# EAGLE design HighVBoard_2.0 (EAGLE 9.6.2)
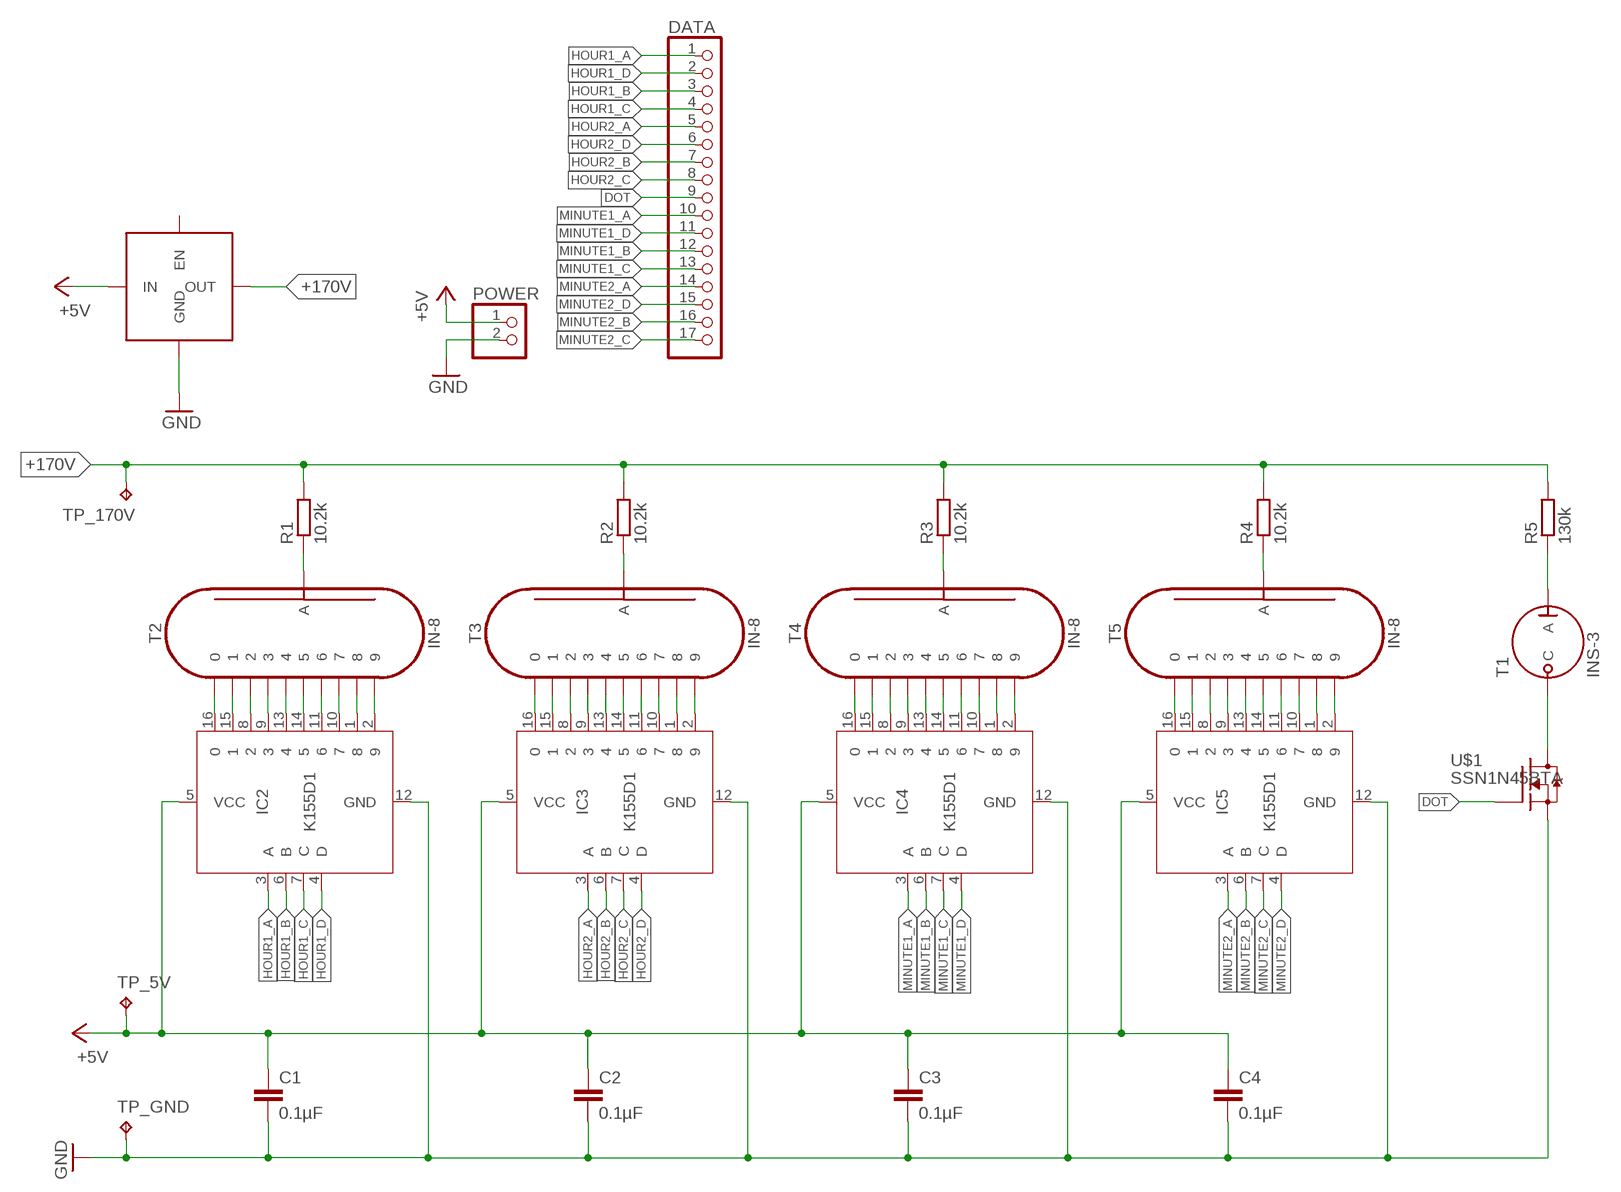
[diagram p0: schematic, sheet 1]

## Parts
C1  0.1µF  C-EU025-024X044  [C025-024X044]
C2  0.1µF  C-EU025-024X044  [C025-024X044]
C3  0.1µF  C-EU025-024X044  [C025-024X044]
C4  0.1µF  C-EU025-024X044  [C025-024X044]
DATA  PINHD-1X17  [1X17]
IC2  K155D1  [DIL16]
IC3  K155D1  [DIL16]
IC4  K155D1  [DIL16]
IC5  K155D1  [DIL16]
POWER  PINHD-1X2  [1X02]
R1  10.2k  R-EU_0207/10  [0207/10]
R2  10.2k  R-EU_0207/10  [0207/10]
R3  10.2k  R-EU_0207/10  [0207/10]
R4  10.2k  R-EU_0207/10  [0207/10]
R5  130k  R-EU_0207/10  [0207/10]
T1  INS-3  [INS-3]
T2  IN-8  [IN-8]
T3  IN-8  [IN-8]
T4  IN-8  [IN-8]
T5  IN-8  [IN-8]
TP_5V  TPPAD1-13  [P1-13]
TP_170V  TPPAD1-13  [P1-13]
TP_GND  TPPAD1-13  [P1-13]
U$1  SSN1N45BTA  [TO92]
U$2  NIXIE-PSU  [NIXIE-PSU]

## Nets
+5V [+5V]: C1.1 C2.1 C3.1 C4.1 IC2.5(VCC) IC3.5(VCC) IC4.5(VCC) IC5.5(VCC) POWER.1 TP_5V.TP U$2.1(IN)
+170V [+170V]: R1.2 R2.2 R3.2 R4.2 R5.2 TP_170V.TP U$2.5(OUT)
DOT: DATA.9 U$1.1(G)
GND [GND]: C1.2 C2.2 C3.2 C4.2 IC2.12(GND) IC3.12(GND) IC4.12(GND) IC5.12(GND) POWER.2 TP_GND.TP U$1.3(S) U$2.2(GND) U$2.4(GND)
HOUR1_A: DATA.1 IC2.3(A)
HOUR1_B: DATA.3 IC2.6(B)
HOUR1_C: DATA.4 IC2.7(C)
HOUR1_D: DATA.2 IC2.4(D)
HOUR2_A: DATA.5 IC3.3(A)
HOUR2_B: DATA.7 IC3.6(B)
HOUR2_C: DATA.8 IC3.7(C)
HOUR2_D: DATA.6 IC3.4(D)
MINUTE1_A: DATA.10 IC4.3(A)
MINUTE1_B: DATA.12 IC4.6(B)
MINUTE1_C: DATA.13 IC4.7(C)
MINUTE1_D: DATA.11 IC4.4(D)
MINUTE2_A: DATA.14 IC5.3(A)
MINUTE2_B: DATA.16 IC5.6(B)
MINUTE2_C: DATA.17 IC5.7(C)
MINUTE2_D: DATA.15 IC5.4(D)
N$1: T1.C U$1.2(D)
N$7 [+170V]: IC2.16 T2.10
N$10 [+170V]: IC2.15 T2.1
N$11 [+170V]: IC2.8 T2.2
N$12 [+170V]: IC2.9 T2.3
N$13 [+170V]: IC2.13 T2.4
N$14 [+170V]: IC2.14 T2.5
N$15 [+170V]: IC2.11 T2.6
N$16 [+170V]: IC2.10 T2.7
N$17 [+170V]: IC2.1 T2.8
N$18 [+170V]: IC2.2 T2.9
N$19 [+170V]: R1.1 T2.A
N$20 [+170V]: IC3.16 T3.10
N$21 [+170V]: IC3.15 T3.1
N$22 [+170V]: IC3.8 T3.2
N$23 [+170V]: IC3.9 T3.3
N$24 [+170V]: IC3.13 T3.4
N$25 [+170V]: IC3.14 T3.5
N$26 [+170V]: IC3.11 T3.6
N$27 [+170V]: IC3.10 T3.7
N$28 [+170V]: IC3.1 T3.8
N$29 [+170V]: IC3.2 T3.9
N$30 [+170V]: R2.1 T3.A
N$31 [+170V]: IC4.16 T4.10
N$32 [+170V]: IC4.15 T4.1
N$33 [+170V]: IC4.8 T4.2
N$34 [+170V]: IC4.9 T4.3
N$35 [+170V]: IC4.13 T4.4
N$36 [+170V]: IC4.14 T4.5
N$37 [+170V]: IC4.11 T4.6
N$38 [+170V]: IC4.10 T4.7
N$39 [+170V]: IC4.1 T4.8
N$40 [+170V]: IC4.2 T4.9
N$41 [+170V]: R3.1 T4.A
N$42 [+170V]: IC5.16 T5.10
N$43 [+170V]: IC5.15 T5.1
N$44 [+170V]: IC5.8 T5.2
N$45 [+170V]: IC5.9 T5.3
N$46 [+170V]: IC5.13 T5.4
N$47 [+170V]: IC5.14 T5.5
N$48 [+170V]: IC5.11 T5.6
N$49 [+170V]: IC5.10 T5.7
N$50 [+170V]: IC5.1 T5.8
N$51 [+170V]: IC5.2 T5.9
N$52 [+170V]: R4.1 T5.A
N$55 [+170V]: R5.1 T1.A
Unconnected: U$2.3(EN)

## Library data of the parts
C1-C4 = rcl:C-EU: CAPACITOR, European symbol; SPICEPREFIX: C
DATA = pinhead:PINHD-1X17: PIN HEADER
IC2-IC5 = Nixie:K155D1
POWER = pinhead:PINHD-1X2: PIN HEADER
R1-R5 = resistor:R-EU_: RESISTOR, European symbol
T1 = Nixie:INS-3
T2-T5 = Nixie:IN-8
TP_5V TP_170V TP_GND = testpad:TP: Test pad
U$1 = Nixie:SSN1N45BTA
U$2 = Nixie:NIXIE-PSU

## Net classes
0 SIGNAL: width 0.203 mm, clearance 0.203 mm
2 +5V: width 0.406 mm, clearance 0.203 mm
3 +170V: width 0.203 mm, clearance 0.406 mm
4 GND: clearance 0.203 mm

## Board
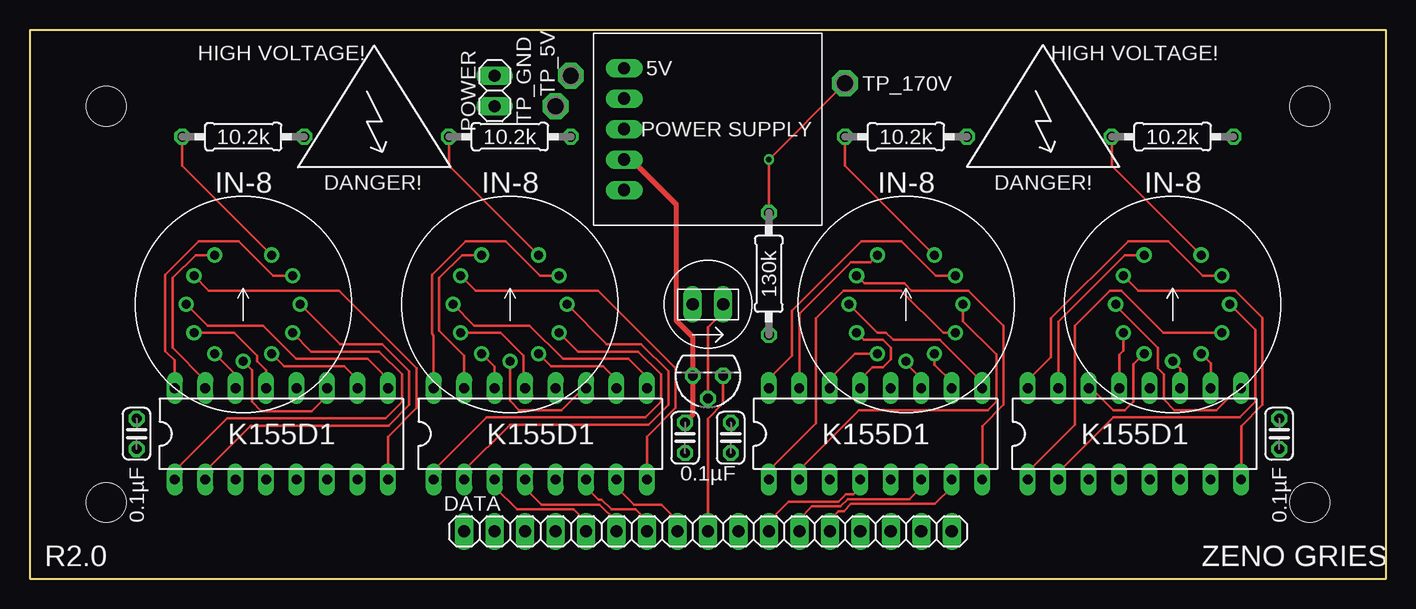
[diagram p1: board, top side]
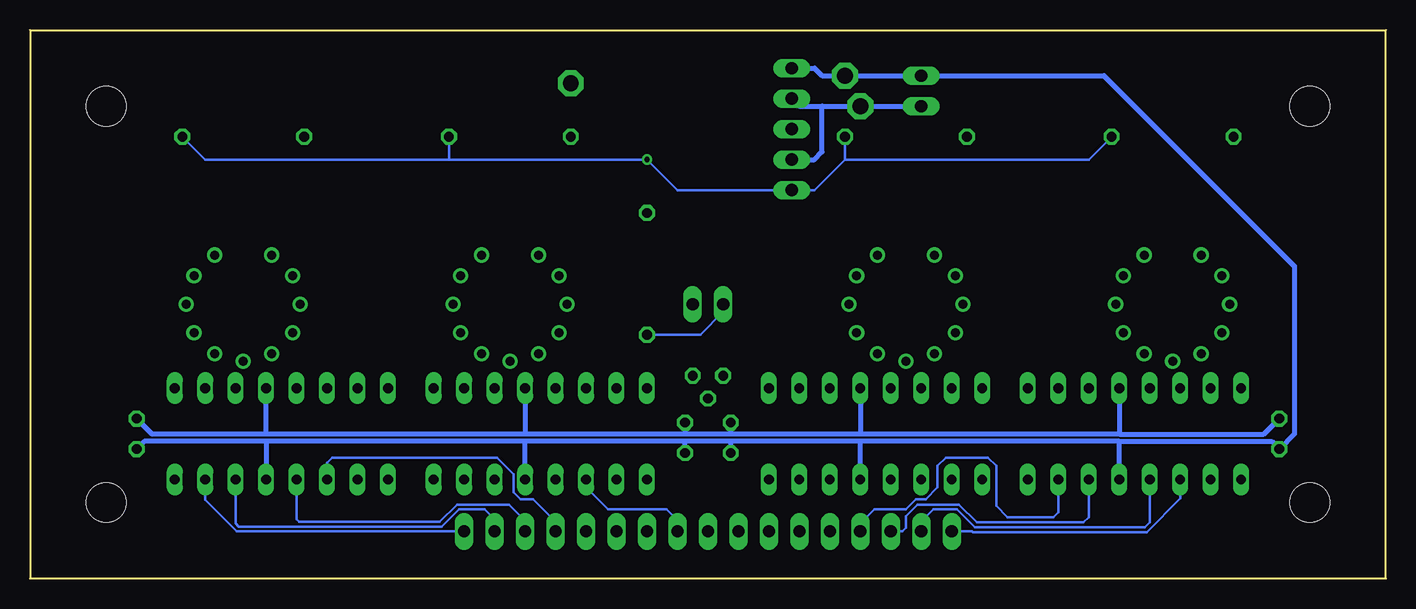
[diagram p2: board, bottom side, seen from below]

Size 113.03 x 45.72 mm. Coordinates in mm from the lower left corner, seen from the top.
Outline: 0,0 0,45.72 113.03,45.72 113.03,0 0,0
Copper layers (1*16): Top 0.035mm / dielectric 1.5mm / Bottom 0.035mm
Design rules "default *": minimum track width 6mil, minimum drill 0.35mm, track to track 6mil, track to pad 6mil, pad to pad 6mil, via to via 6mil, smd to smd 6mil, copper to edge 40mil, drill to drill 6mil, minimum pad ring 10mil, minimum via ring 8mil, stop-mask expansion 4mil, vias tented up to drill 14mil, thermal gap 10mil
Holes 3.3 mm at 6.35,39.37 6.35,6.35 106.68,39.37 106.68,6.35

### Footprints (pad centres in the part's own frame; a part is rotated, then mirrored left to right if it is on the bottom)
C025-024X044 = drill 0.813 octagon: 1 -1.27,0; 2 1.27,0
1X17 = drill 1.016 long: 1 -20.32,0; 2 -17.78,0; 3 -15.24,0; 4 -12.7,0; 5 -10.16,0; 6 -7.62,0; 7 -5.08,0; 8 -2.54,0; 9 0,0; 10 2.54,0; 11 5.08,0; 12 7.62,0; 13 10.16,0; 14 12.7,0; 15 15.24,0; 16 17.78,0; 17 20.32,0
DIL16 = drill 0.813 long: 1 -8.89,-3.81; 2 -6.35,-3.81; 3 -3.81,-3.81; 4 -1.27,-3.81; 5 1.27,-3.81; 6 3.81,-3.81; 7 6.35,-3.81; 8 8.89,-3.81; 9 8.89,3.81; 10 6.35,3.81; 11 3.81,3.81; 12 1.27,3.81; 13 -1.27,3.81; 14 -3.81,3.81; 15 -6.35,3.81; 16 -8.89,3.81
1X02 = drill 1.016 long: 1 -1.27,0; 2 1.27,0
0207/10 = drill 0.813 octagon: 1 -5.08,0; 2 5.08,0
INS-3 = drill 1.016 long: A -1.27,0; C 1.27,0
IN-8 = drill 0.75: 1 -2.375,4.11; 2 -4.11,2.375; 3 -4.75,0; 4 -4.11,-2.375; 5 -2.375,-4.11; 6 0,-4.75; 7 2.375,-4.11; 8 4.11,-2.375; 9 4.75,0; 10 4.11,2.375; A 2.375,4.11
P1-13 = drill 1.321 pad 2.159 octagon: TP 0,0
TO92 = drill 0.813 octagon: 1 -1.27,0; 2 0,1.905; 3 1.27,0
NIXIE-PSU = drill 1.016 long: 1 -5.08,0; 2 -2.54,0; 3 0,0; 4 2.54,0; 5 5.08,0

### Placement (x,y rotation side)
C1  54.61,11.73 90 top
C2  8.89,12.06 90 top
C3  58.42,11.73 90 top
C4  104.14,12.06 90 top
DATA  56.52,3.94 0 top
IC2  20.95,12.06 0 top
IC3  42.55,12.06 0 top
IC4  70.48,12.06 0 top
IC5  92.08,12.06 0 top
POWER  38.73,40.64 270 top
R1  17.78,36.83 0 top
R2  40.01,36.83 0 top
R3  73.03,36.83 0 top
R4  95.25,36.83 0 top
R5  61.59,25.4 90 top
T1  56.52,22.86 0 top
T2  17.78,22.86 0 top
T3  40.01,22.86 0 top
T4  73.03,22.86 0 top
T5  95.25,22.86 0 top
TP_5V  45.09,41.91 0 top
TP_170V  67.94,41.27 0 top
TP_GND  43.81,39.37 0 top
U$1  56.52,16.92 180 top
U$2  49.53,37.47 270 top

### Tracks (layer width: path | path; a pad name or v marks a point on that pad's centre or on a via)
+5V
  Bottom 0.406: IC2.5 22.23,11.43 | 22.23,11.43 43.81,11.43 | 43.81,11.43 54.61,11.43 | 54.61,11.43 58.42,11.43 | 58.42,11.43 71.75,11.43 | IC4.5 71.75,11.43 | IC3.5 43.81,11.43 | 71.75,11.43 93.34,11.43 | 93.34,11.43 IC5.5 | U$2.1 47.62,42.55 46.99,41.91 TP_5V.TP POWER.1 23.5,41.91 7.62,26.04 7.62,12.06 C2.1 9.53,11.43 22.23,11.43 | C1.1 54.61,11.43 | C3.1 58.42,11.43 | 93.34,11.43 103.5,11.43 C4.1
+170V  (via drill 0.45)
  Top 0.203: R5.2 v61.59,34.92 TP_170V.TP
  Bottom 0.203: 78.11,34.92 v61.59,34.92 59.05,32.38 U$2.5 47.62,32.38 45.09,34.92 | 78.11,34.92 98.42,34.92 R4.2 | R3.2 78.11,34.92 | R1.2 24.77,34.92 45.09,34.92 | R2.2 45.09,34.92
DOT
  Top 0.203: DATA.9 56.52,13.34 57.78,14.61 U$1.1
GND
  Top 0.406: U$2.4 50.16,34.92 53.87,31.22 53.87,21.53 55.24,20.16 U$1.3 55.24,13.64 C1.2
  Bottom 0.406: POWER.2 TP_GND.TP 46.99,39.37 | IC2.12 22.23,12.04 | 22.23,12.04 43.81,12.04 | 43.81,12.04 54.61,12.04 | 54.61,12.04 58.42,12.04 | 58.42,12.04 71.75,12.04 | 71.75,12.04 93.32,12.04 | 93.32,12.04 93.34,12.06 IC5.12 | IC3.12 43.81,12.04 | IC4.12 71.75,12.04 | U$2.2 48.9,39.37 46.99,39.37 | 54.61,12.04 C1.2 | C3.2 58.42,12.04 | 22.23,12.04 10.19,12.04 C2.2 | 93.32,12.04 102.84,12.04 C4.2 | U$2.4 47.62,34.92 46.99,35.56 46.99,39.37
HOUR1_A
  Bottom 0.203: DATA.1 34.49,3.94 34.44,3.89 19.94,3.89 17.14,6.68 IC2.3
HOUR1_B
  Bottom 0.203: IC2.6 24.77,5.13 25.2,4.7 34.11,4.7 35.59,6.17 39.04,6.17 40.01,5.21 40.01,4.24 40.31,3.94 DATA.3
HOUR1_C
  Bottom 0.203: IC2.7 27.3,5.54 27.74,5.11 31.53,5.11 32.49,6.06 32.49,9.4 33.17,10.08 36.68,10.08 37.36,9.4 37.36,7.6 38.34,6.63 39.16,6.63 40.02,5.77 42.62,5.77 43.81,4.57 DATA.4
HOUR1_D
  Bottom 0.203: IC2.4 19.69,8.25 19.69,4.71 20.11,4.29 34.28,4.29 35.75,5.77 37.72,5.77 38.73,4.75 DATA.2
HOUR2_A
  Top 0.203: DATA.5 46.35,4.72 45.31,5.77 40.64,5.77 40.59,5.77 38.73,7.62 IC3.3
HOUR2_B
  Top 0.203: DATA.7 51.44,4.83 50.49,5.77 48.48,5.77 47.67,6.58 47.4,6.58 46.35,7.62 IC3.6
HOUR2_C
  Top 0.203: DATA.8 53.98,4.83 52.63,6.17 50.34,6.17 48.9,7.62 IC3.7
HOUR2_D
  Top 0.203: DATA.6 48.9,4.78 47.5,6.17 42.65,6.17 41.27,7.54 IC3.4
MINUTE1_A
  Bottom 0.203: DATA.10 59.05,4.88 59.97,5.79 64.85,5.79 66.67,7.62 IC4.3
MINUTE1_B
  Top 0.203: DATA.12 64.14,4.95 65.2,6.02 67.58,6.02 68.19,6.63 73.3,6.63 74.3,7.62 IC4.6
MINUTE1_C
  Top 0.203: DATA.13 66.67,4.88 67.41,5.61 67.84,5.61 68.45,6.22 75.44,6.22 76.83,7.62 IC4.7
MINUTE1_D
  Top 0.203: DATA.11 61.59,4.78 63.25,6.43 66.67,6.43 66.88,6.43 67.41,6.43 68.02,7.04 68.63,7.04 69.22,7.62 IC4.4
MINUTE2_A
  Bottom 0.203: DATA.14 69.22,4.75 71.09,6.63 72.16,6.63 72.72,7.2 72.72,8.71 74.1,10.08 75.37,10.08 75.56,10.08 87.86,10.08 88.27,9.68 IC5.3
MINUTE2_B
  Bottom 0.203: DATA.16 74.3,4.91 75.15,5.77 77.28,5.77 78.7,4.34 95.61,4.34 95.89,4.62 IC5.6
MINUTE2_C
  Bottom 0.203: DATA.17 95.78,3.94 98.42,6.58 IC5.7
MINUTE2_D
  Bottom 0.203: DATA.15 71.75,4.84 73.09,6.17 77.44,6.17 78.87,4.75 90.6,4.75 90.81,4.95 IC5.4
N$1
  Top 0.203: U$1.2 56.52,20.95 57.78,22.23 T1.C
N$7
  Top 0.203: IC2.16 12.06,18.19 11.28,18.97 11.28,25.32 14.07,28.11 17.41,28.11 20.28,25.23 T2.10
N$10
  Top 0.203: T2.1 13.8,26.97 11.89,25.07 11.89,19.22 14.61,16.51 IC2.15
N$11
  Top 0.203: IC2.8 29.84,11.84 32.23,14.23 32.23,17.52 25.76,24 14.91,24 T2.2
N$12
  Top 0.203: T2.3 14.79,21.09 19.42,21.09 22.2,18.31 28.14,18.31 29.84,16.61 IC2.9
N$13
  Top 0.203: IC2.13 19.68,17.35 18.92,18.11 18.92,18.58 17.01,20.48 T2.4
N$14
  Top 0.203: T2.5 17.14,17.01 IC2.14
N$15
  Top 0.203: T2.6 18.52,17.37 18.52,14.73 19.28,13.97 23.5,13.97 24.77,15.24 IC2.11
N$16
  Top 0.203: T2.7 21.2,17.7 26.19,17.7 27.3,16.59 IC2.10
N$17
  Top 0.203: IC2.1 12.06,8.99 16.43,13.36 29.64,13.36 31.01,14.73 31.01,17.02 29.11,18.92 23.45,18.92 T2.8
N$18
  Top 0.203: IC2.2 14.61,8.94 18.41,12.75 29.9,12.75 31.62,14.48 31.62,17.27 29.36,19.53 25.86,19.53 T2.9
N$19
  Top 0.203: T2.A 12.7,34.42 R1.1
N$20
  Top 0.203: IC3.16 33.66,20.25 33.51,20.4 33.51,25.32 36.3,28.11 39.63,28.11 42.51,25.23 T3.10
N$21
  Top 0.203: T3.1 36.02,26.97 34.12,25.07 34.12,20.65 36.2,18.58 IC3.15
N$22
  Top 0.203: IC3.8 51.44,11.84 53.82,14.23 53.82,17.52 47.35,24 37.13,24 T3.2
N$23
  Top 0.203: IC3.9 51.44,16.76 49.89,18.31 44.42,18.31 41.64,21.09 37.02,21.09 T3.3
N$24
  Top 0.203: IC3.13 41.14,16.01 41.14,18.58 39.24,20.48 T3.4
N$25
  Top 0.203: IC3.14 38.73,17.64 T3.5
N$26
  Top 0.203: IC3.11 46.13,15.88 44.3,14.05 40.79,14.05 40.01,14.83 T3.6
N$27
  Top 0.203: IC3.10 48.9,16.59 47.78,17.7 43.43,17.7 T3.7
N$28
  Top 0.203: IC3.1 33.66,9.04 38.05,13.44 51.31,13.44 52.6,14.73 52.6,17.02 50.7,18.92 45.68,18.92 T3.8
N$29
  Top 0.203: IC3.2 36.2,9.02 40.01,12.83 51.56,12.83 53.21,14.48 53.21,17.27 50.95,19.53 48.08,19.53 T3.9
N$30
  Top 0.203: T3.A 34.92,34.42 R2.1
N$31
  Top 0.203: IC4.16 61.59,16.64 63.52,18.57 63.52,22.32 69.32,28.11 72.66,28.11 75.53,25.23 T4.10
N$32
  Top 0.203: T4.1 70.05,26.37 68.44,26.37 64.14,22.06 IC4.15
N$33
  Top 0.203: T4.2 69.54,24.61 72.88,24.61 73.48,24 78.25,24 81.15,21.09 81.15,14.48 79.38,12.7 IC4.8
N$34
  Top 0.203: IC4.9 79.38,16.38 75.87,19.89 71.98,19.89 71.37,20.5 70.64,20.5 T4.3
N$35
  Top 0.203: IC4.13 69.22,16.61 70.22,17.61 71.12,17.61 71.79,18.28 71.79,19.22 71.12,19.89 69.51,19.89 T4.4
N$36
  Top 0.203: IC4.14 66.67,16.64 68.79,18.75 T4.5
N$37
  Top 0.203: IC4.11 74.3,16.66 73.03,17.93 T4.6
N$38
  Top 0.203: IC4.10 76.83,16.41 75.4,17.84 T4.7
N$39
  Top 0.203: T4.8 76.14,20.48 72.62,24 67.8,24 65.51,21.7 65.51,12.95 61.59,9.04 IC4.1
N$40
  Top 0.203: IC4.2 64.14,9.09 69.09,14.05 79.86,14.05 80.54,14.73 80.54,18.68 77.78,21.45 T4.9
N$41
  Top 0.203: T4.A 67.94,34.42 R3.1
N$42
  Top 0.203: IC5.16 83.19,16.54 85.11,18.47 85.11,21.68 91.54,28.11 94.88,28.11 97.75,25.23 T5.10
N$43
  Top 0.203: IC5.15 85.72,21.43 91.27,26.97 T5.1
N$44
  Top 0.203: IC5.8 100.97,12.7 102.74,14.48 102.74,21.73 100.47,24 92.38,24 T5.2
N$45
  Top 0.203: IC5.9 100.74,15.88 98.91,14.05 95.4,14.05 94.51,14.93 94.51,17.02 94.01,17.52 94.01,19.22 90.5,22.73 T5.3
N$46
  Top 0.203: IC5.13 90.81,18.64 91.14,18.98 T5.4
N$47
  Top 0.203: IC5.14 88.49,15.88 90.32,14.05 91.29,14.05 91.97,14.73 91.97,17.85 T5.5
N$48
  Top 0.203: T5.6 95.89,17.48 IC5.11
N$49
  Top 0.203: T5.7 98.42,17.95 IC5.10
N$50
  Top 0.203: IC5.1 83.19,8.91 87.1,12.83 87.1,21.07 90.03,24 90.97,24 94.48,20.48 T5.8
N$51
  Top 0.203: IC5.2 85.72,8.87 90.3,13.44 100.84,13.44 102.13,14.73 102.13,20.73 T5.9
N$52
  Top 0.203: T5.A 90.17,34.42 R4.1
N$55
  Bottom 0.203: T1.A 55.24,22.23 57.15,20.32 R5.1

### Text on the board
tPlace: 5V | POWER SUPPLY
tNames: HIGH VOLTAGE! | HIGH VOLTAGE! | IN-8 | DANGER! | IN-8 | IN-8 | DANGER! | IN-8 | R2.0 | ZENO GRIES